# EAGLE schematic Anchor_v2 (EAGLE 9.5.2)
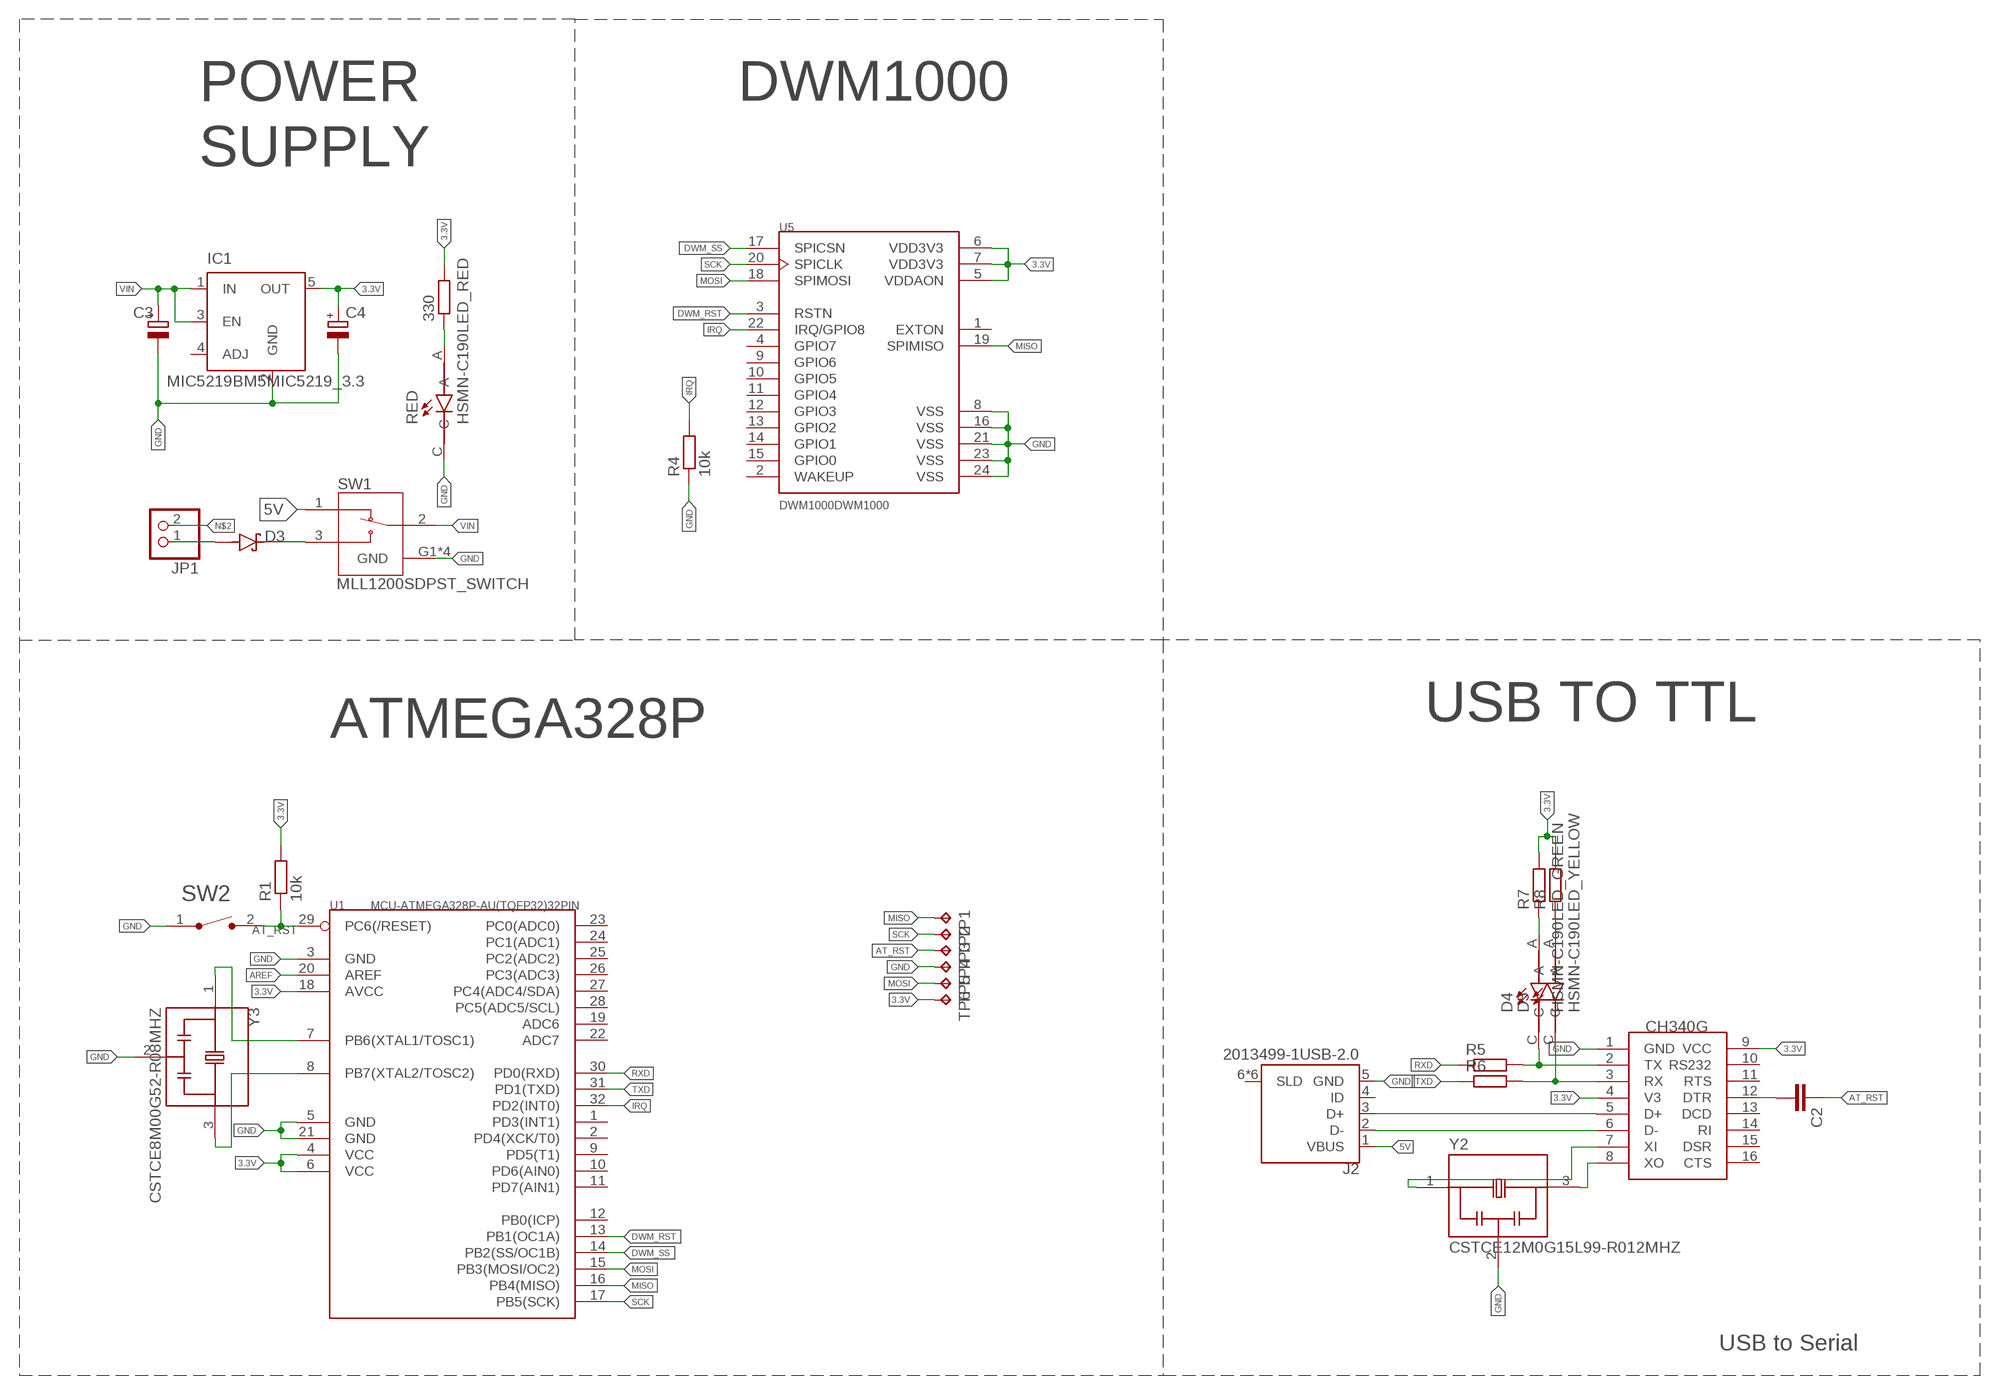
[diagram p0: schematic, sheet 1]

## Parts
330  R-EU_R0603  [R0603]
C2  C-EUC0603  [C0603]
C3  CPOL-EUA/3216-18R  [A/3216-18R]
C4  CPOL-EUA/3216-18R  [A/3216-18R]
D3  1N5819HW-7-FSCHOTTKEYDIODE  [SOD3715X145N_NEW]
D4  HSMN-C190LED_GREEN  [LEDM1608X80_NEW]
D5  HSMN-C190LED_YELLOW  [LEDM1608X80_NEW]
IC1  MIC5219BM5MIC5219_3.3  [SOT23-5_NEW]
J2  2013499-1USB-2.0  [TE_2013499-1_NEW]
JP1  PINHD-1X2  [1X02]
R1  10k  R-EU_R0603  [R0603]
R4  10k  R-EU_R0603  [R0603]
R5  R-EU_R0603  [R0603]
R6  R-EU_R0603  [R0603]
R7  R-EU_R0603  [R0603]
R8  R-EU_R0603  [R0603]
RED  HSMN-C190LED_RED  [LEDM1608X80_NEW]
SW1  MLL1200SDPST_SWITCH  [SW_MLL1200S_NEW]
SW2  FSMSMRESET_SPST  [TE_FSMSM_NEW]
TP1  TPB1,27  [B1,27]
TP2  TPB1,27  [B1,27]
TP3  TPB1,27  [B1,27]
TP4  TPB1,27  [B1,27]
TP5  TPB1,27  [B1,27]
TP6  TPB1,27  [B1,27]
U1  MCU-ATMEGA328P-AU(TQFP32)32PIN  [TQFP32-0.8-7X7MM_NEW]
U5  DWM1000DWM1000  [XCVR_DWM1000_NEW]
U$1  CH340G16PIN  [SOIC16_NEW]
Y2  CSTCE12M0G15L99-R012MHZ  [OSC_CSTCE12M0G15L99-R0_NEW]
Y3  CSTCE8M00G52-R08MHZ  [OSC_CSTCE8M00G52-R0_NEW]

## Nets
3.3V: 330.2 C4.+ IC1.5(OUT) R1.2 R7.2 R8.2 TP6.TP U1.4(VCC) U1.6(VCC) U1.18(AVCC) U5.5(VDDAON) U5.6(VDD3V3) U5.7(VDD3V3) U$1.4(V3) U$1.9(VCC)
5V: J2.1(VBUS) SW1.1
AREF: U1.20(AREF)
AT_RST: C2.1 R1.1 SW2.2 TP3.TP U1.29(PC6(/RESET))
DWM_RST: U1.13(PB1(OC1A)) U5.3(RSTN)
DWM_SS: U1.14(PB2(SS/OC1B)) U5.17(SPICSN)
GND: C3.- C4.- IC1.2(GND) J2.5(GND) R4.1 RED.C SW1.G1(GND) SW1.G2(GND) SW1.G3(GND) SW1.G4(GND) SW2.1 TP4.TP U1.3(GND) U1.5(GND) U1.21(GND) U5.8(VSS) U5.16(VSS) U5.21(VSS) U5.23(VSS) U5.24(VSS) U$1.1(GND) Y2.2 Y3.2
IRQ: R4.2 U1.32(PD2(INT0)) U5.22(IRQ/GPIO8)
MISO: TP1.TP U1.16(PB4(MISO)) U5.19(SPIMISO)
MOSI: TP5.TP U1.15(PB3(MOSI/OC2)) U5.18(SPIMOSI)
N$1: U1.7(PB6(XTAL1/TOSC1)) Y3.1
N$2: JP1.2
N$3: D3.A JP1.1
N$4: D3.C(K) SW1.3
N$5: U1.8(PB7(XTAL2/TOSC2)) Y3.3
N$6: 330.1 RED.A
N$13: D4.C R5.2 U$1.2(TX)
N$14: C2.2 U$1.12(DTR)
N$15: U$1.8(XO) Y2.3
N$17: D5.C R6.2 U$1.3(RX)
N$18: D4.A R7.1
N$19: D5.A R8.1
N$20: U$1.7(XI) Y2.1
N$21: J2.2(D-) U$1.6(D-)
N$23: J2.3(D+) U$1.5(D+)
RXD: R5.1 U1.30(PD0(RXD))
SCK: TP2.TP U1.17(PB5(SCK)) U5.20(SPICLK)
TXD: R6.1 U1.31(PD1(TXD))
VIN: C3.+ IC1.1(IN) IC1.3(EN) SW1.2
Unconnected: IC1.4(ADJ) J2.4(ID) J2.6(SLD) J2.7(SLD) J2.8(SLD) J2.9(SLD) J2.10(SLD) J2.11(SLD) U1.1(PD3(INT1)) U1.2(PD4(XCK/T0)) U1.9(PD5(T1)) U1.10(PD6(AIN0)) U1.11(PD7(AIN1)) U1.12(PB0(ICP)) U1.19(ADC6) U1.22(ADC7) U1.23(PC0(ADC0)) U1.24(PC1(ADC1)) U1.25(PC2(ADC2)) U1.26(PC3(ADC3)) U1.27(PC4(ADC4/SDA)) U1.28(PC5(ADC5/SCL)) U5.1(EXTON) U5.2(WAKEUP) U5.4(GPIO7) U5.9(GPIO6) U5.10(GPIO5) U5.11(GPIO4) U5.12(GPIO3) U5.13(GPIO2) U5.14(GPIO1) U5.15(GPIO0) U$1.10(RS232) U$1.11(RTS) U$1.13(DCD) U$1.14(RI) U$1.15(DSR) U$1.16(CTS)

## Notes on the sheet
- POWER | DWM1000
- SUPPLY
- ATMEGA328P | USB TO TTL
- USB to Serial

## Library data of the parts
330 R1 R4-R8 = rcl:R-EU_: RESISTOR, European symbol; SPICEPREFIX: R
C2 = rcl:C-EU: CAPACITOR, European symbol; SPICEPREFIX: C
C3 C4 = rcl:CPOL-EU: POLARIZED CAPACITOR, European symbol; SPICEPREFIX: C
D3 = 1N5819HW-7-F:1N5819HW-7-F: 1N5819HW Series 40 V 1 A Surface Mount Schottky Barrier Rectifier - SOD-123
D4 = led_green:HSMN-C190: LED; SMD; 0603; blue; 11.2-35mcd; 1.6x0.8x0.8mm; 170°; 3.3÷3.9V
D5 = led_yellow:HSMN-C190: LED; SMD; 0603; blue; 11.2-35mcd; 1.6x0.8x0.8mm; 170°; 3.3÷3.9V
IC1 = MIC5219BM5:MIC5219BM5: VOLTAGE REGULATOR
J2 = 2013499-1:2013499-1: CONN PCB USB 5POS
JP1 = pinhead:PINHD-1X2: PIN HEADER
RED = led_red:HSMN-C190: LED; SMD; 0603; blue; 11.2-35mcd; 1.6x0.8x0.8mm; 170°; 3.3÷3.9V
SW1 = MLL1200S:MLL1200S: Switch Slide SPDT Side Slide 0.3A 4VDC Gull Wing SMD Box
SW2 = FSMSM:FSMSM: Switch Tactile OFF (ON) SPST Rectangular Button Gull Wing 0.05A 12VDC SMD Loose Piece
TP1-TP6 = testpad:TP: Test pad
U1 = MCU-ATMEGA328P-AU_TQFP32_:MCU-ATMEGA328P-AU(TQFP32): 310010049
U5 = DWM1000:DWM1000: Mod Ieee802.15.4-2011 Uwb Txrx
U$1 = ch340g:CH340G
Y2 = CSTCE12M0G15L99-R0:CSTCE12M0G15L99-R0: CSTCE Series 3.2 x 1.3 x 0.7 mm 12 MHz ±0.1 % Built-in Capacitor SMT Resonator
Y3 = CSTCE8M00G52-R0:CSTCE8M00G52-R0: CSTCE Series 8 MHz 3.2 x 1.3 x 0.7 mm Built-in Capacitor SMT Resonator